# Altium schematic sheet 08 CAN PHY & ETHERNET P.SchDoc
size 513 x 386 mm
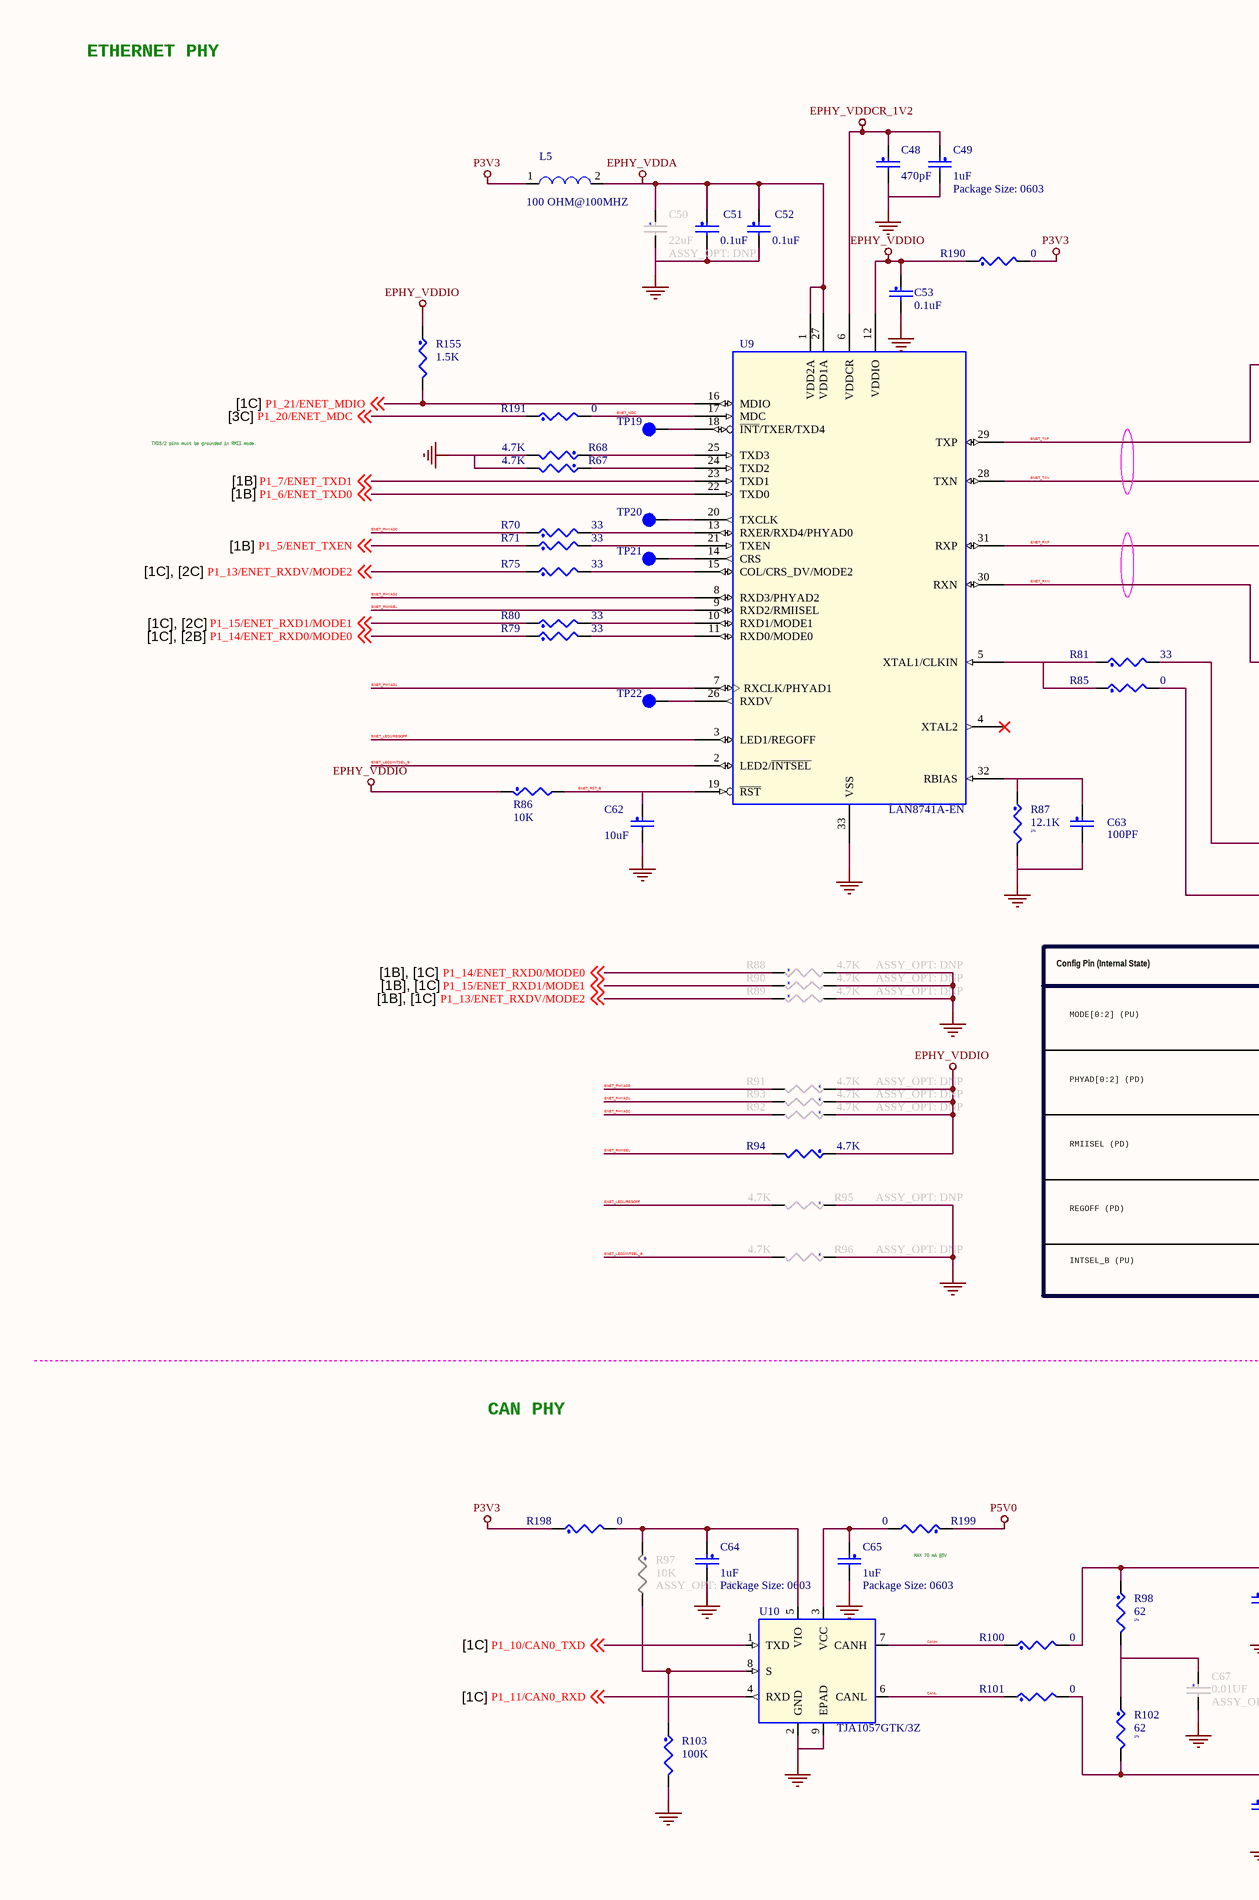
[diagram p0: 08 CAN PHY & ETHERNET P.SchDoc, left]
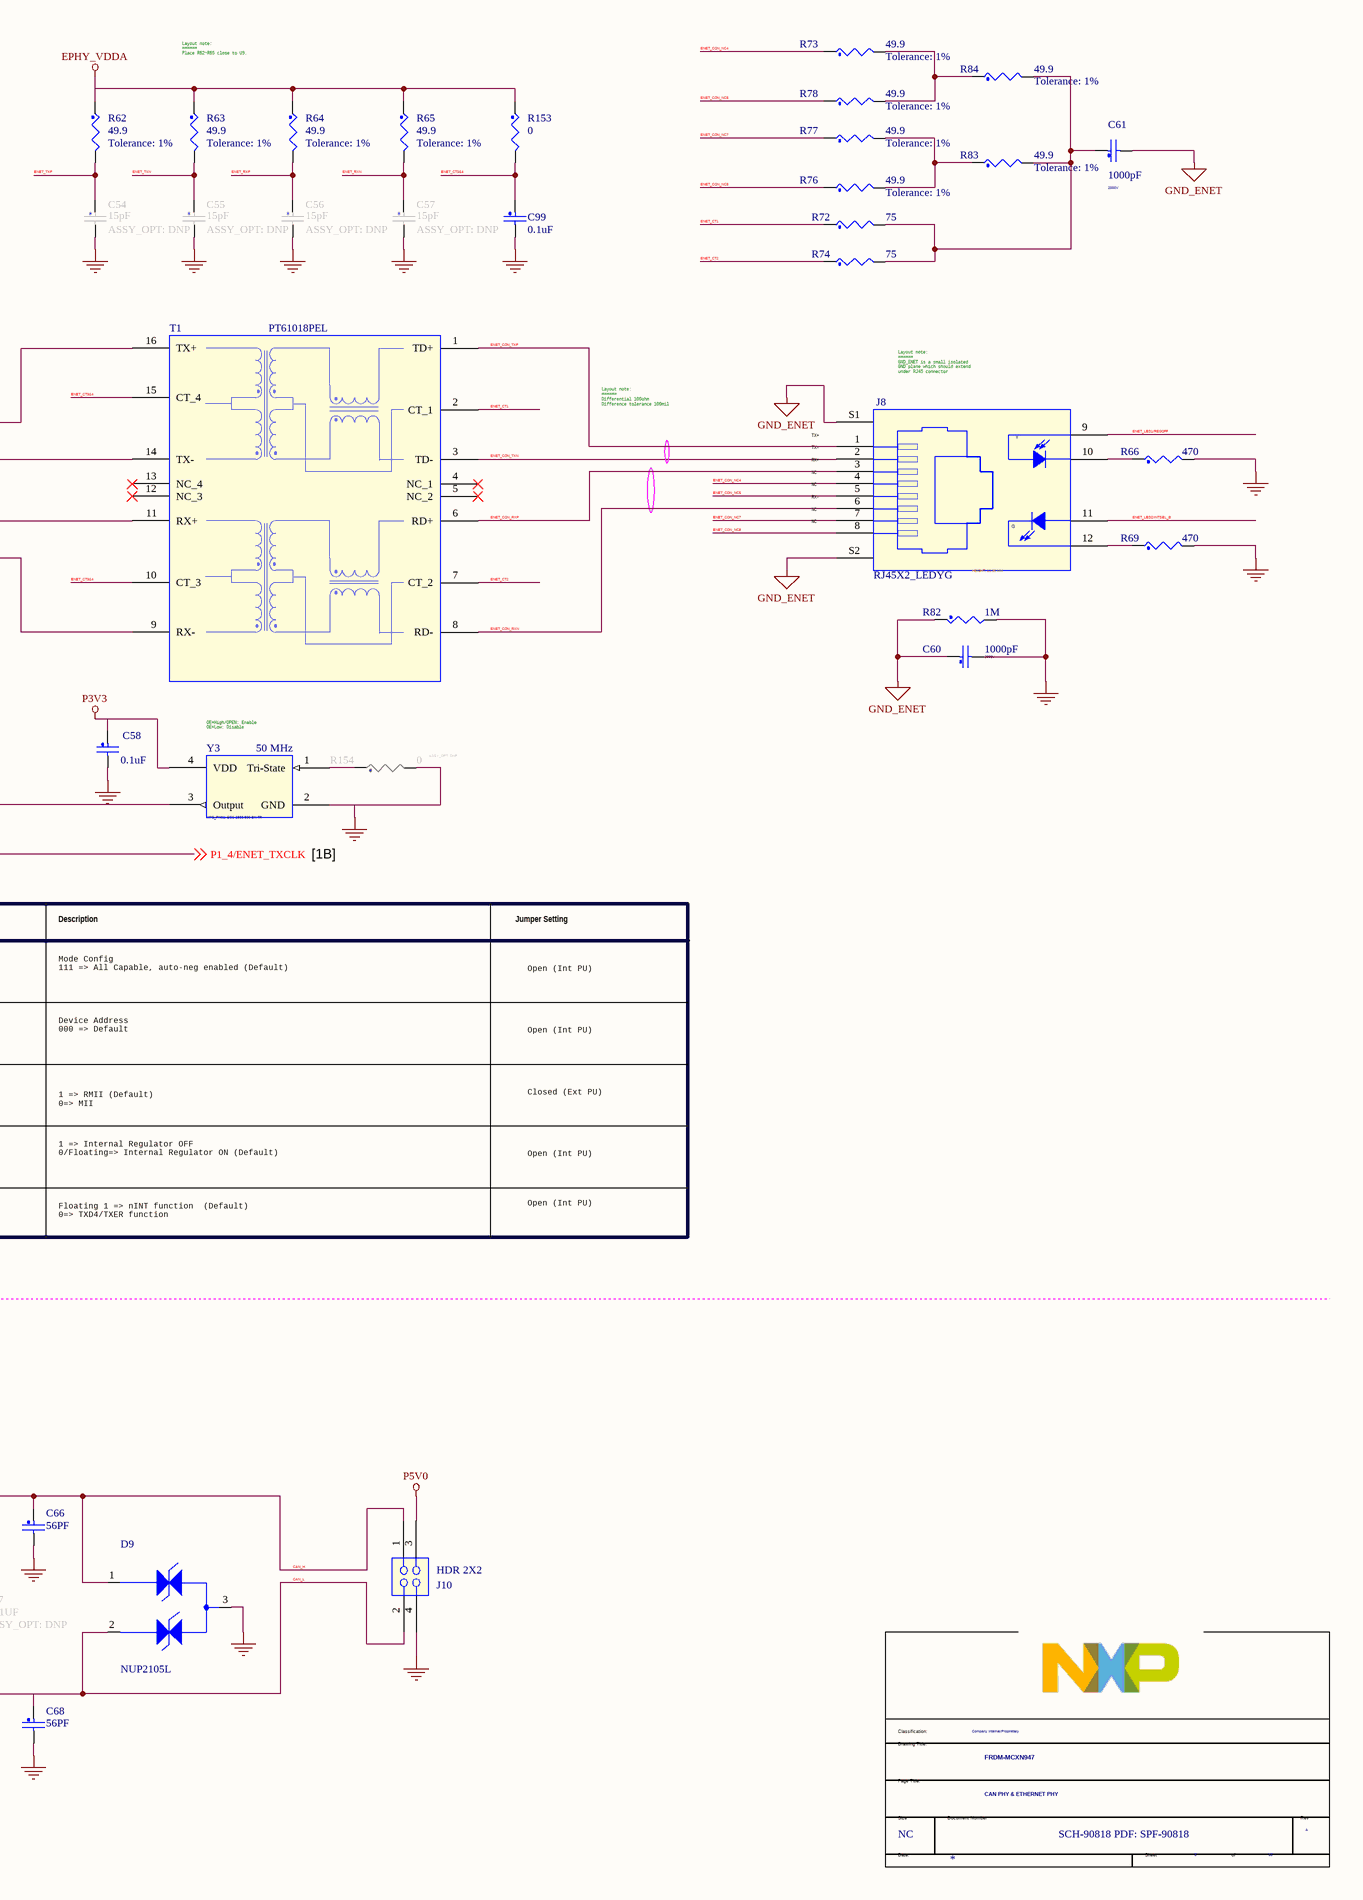
[diagram p1: 08 CAN PHY & ETHERNET P.SchDoc, right]

## Parts
*  Doc: SCH-90818 PDF: SPF-90818  RevCode: A  Title: FRDM-MCXN947  Page Size: NC  Page Number: 8  Page Count: 13  PageTitle: CAN PHY & ETHERNET PHY  Classification: Company Internal/Proprietary  (hidden comment: TitleBlock_FS)  (graphical)
C48  470pF  [CC0402_25]
C49  1uF  Package Size: 0603  [CC0603_OV]
C50  22uF  ASSY_OPT: DNP  [CC0603_OV]
C51  0.1uF  [CC0402_25]
C52  0.1uF  [CC0402_25]
C53  0.1uF  [CC0402_25]
C54  15pF  ASSY_OPT: DNP  [CC0402_25]
C55  15pF  ASSY_OPT: DNP  [CC0402_25]
C56  15pF  ASSY_OPT: DNP  [CC0402_25]
C57  15pF  ASSY_OPT: DNP  [CC0402_25]
C58  0.1uF  [CC0402_25]
C60  1000pF  Rated Voltage: 2000V  [CC1206_OV]
C61  1000pF  Rated Voltage: 2000V  [CC1206_OV]
C62  10uF  [CC0603_OV]
C63  100PF  [CC0402_25]
C64  1uF  Package Size: 0603  [CC0603_OV]
C65  1uF  Package Size: 0603  [CC0603_OV]
C66  56PF  [CC0402_25]
C67  0.01UF  ASSY_OPT: DNP  [CC0402_25]
C68  56PF  [CC0402_25]
C99  0.1uF  [CC0402_25]
D9  NUP2105L  [sot-23]
J8  RJ45X2_LEDYG  HEIGHT: 11.35 MM  [con12p_1p02_16p48x15p5_ra_th]
J10  HDR 2X2  [hdr2x2_2p54_th]
L5  100 OHM@100MHZ  [ind_1608]
R62  49.9  Tolerance: 1%  [RC0402_25]
R63  49.9  Tolerance: 1%  [RC0402_25]
R64  49.9  Tolerance: 1%  [RC0402_25]
R65  49.9  Tolerance: 1%  [RC0402_25]
R66  470  [RC0402_25]
R67  4.7K  [RC0402_25]
R68  4.7K  [RC0402_25]
R69  470  [RC0402_25]
R70  33  [RC0402_25]
R71  33  [RC0402_25]
R72  75  [RC0402_25]
R73  49.9  Tolerance: 1%  [RC0402_25]
R74  75  [RC0402_25]
R75  33  [RC0402_25]
R76  49.9  Tolerance: 1%  [RC0402_25]
R77  49.9  Tolerance: 1%  [RC0402_25]
R78  49.9  Tolerance: 1%  [RC0402_25]
R79  33  [RC0402_25]
R80  33  [RC0402_25]
R81  33  [RC0402_25]
R82  1M  [RC0805_OV]
R83  49.9  Tolerance: 1%  [RC0402_25]
R84  49.9  Tolerance: 1%  [RC0402_25]
R85  0  [RC0603_OV]
R86  10K  [RC0402_25]
R87  12.1K  Tolerance: 1%  [RC0402_25]
R88  4.7K  ASSY_OPT: DNP  [RC0402_25]
R89  4.7K  ASSY_OPT: DNP  [RC0402_25]
R90  4.7K  ASSY_OPT: DNP  [RC0402_25]
R91  4.7K  ASSY_OPT: DNP  [RC0402_25]
R92  4.7K  ASSY_OPT: DNP  [RC0402_25]
R93  4.7K  ASSY_OPT: DNP  [RC0402_25]
R94  4.7K  [RC0402_25]
R95  4.7K  ASSY_OPT: DNP  [RC0402_25]
R96  4.7K  ASSY_OPT: DNP  [RC0402_25]
R97  10K  ASSY_OPT: DNP  [RC0402_25]
R98  62  Tolerance: 1%  [RC0805_OV]
R100  0  [RC0603_OV]
R101  0  [RC0603_OV]
R102  62  Tolerance: 1%  [RC0805_OV]
R103  100K  [RC0402_25]
R153  0  [RC0603_OV]
R154  0  ASSY_OPT: DNP  [RC0603_OV]
R155  1.5K  [RC0402_25]
R190  0  [RC0603_OV]
R191  0  [RC0603_OV]
R198  0  [RC0402_25]
R199  0  [RC0402_25]
T1  PT61018PEL  [xfmr16_1p27_13p05x7p15]
TP19  TPAD_030  [TPAD_030]  (value not drawn)
TP20  TPAD_030  [TPAD_030]  (value not drawn)
TP21  TPAD_030  [TPAD_030]  (value not drawn)
TP22  TPAD_030  [TPAD_030]  (value not drawn)
U9  LAN8741A-EN  [QFN32EP]
U10  TJA1057GTK/3Z  [son8_0p65_3p15x3p15]
Y3  50 MHz  MFG_PN01: ECS-2333-500-BN-TR  [osc4_3p2x2p5_sm]

## Nets
EPHY_VDDA: C50.1 C51.1 C52.1 L5.2 R62.1 R63.1 R64.1 R65.1 R153.1 U9.1(VDD2A) U9.27(VDD1A)
EPHY_VDDCR_1V2: C48.1 C49.1 U9.6(VDDCR)
EPHY_VDDIO: C53.1 R86.1 R91.1 R92.1 R93.1 R94.1 R155.1 R190.1 U9.12(VDDIO)
GND: C48.2 C49.2 C50.2 C51.2 C52.2 C53.2 C54.2 C55.2 C56.2 C57.2 C58.2 C60.2 C62.2 C63.2 C64.2 C65.2 C66.2 C67.2 C68.2 C99.2 D9.3(ANODES) J10.4(B2) R66.2 R67.2 R68.2 R69.2 R82.2 R87.2 R88.2 R89.2 R90.2 R95.1 R96.1 R103.2 R154.2 U9.33(VSS) U10.2(GND) U10.9(EPAD) Y3.2(GND)
GND_ENET: C60.1 C61.2 J8.S1(SHIELD_1) J8.S2(SHIELD_2) R82.1
P3V3: C58.1 L5.1 R190.2 R198.1 Y3.4(VDD)
P5V0: J10.3(A2) R199.1
CAN_H: C66.1 D9.1(CATHODE1) J10.1(A1) R98.1 R100.2
CAN_L: C68.1 D9.2(CATHODE2) J10.2(B1) R101.2 R102.2
CANH: R100.1 U10.7(CANH)
CANL: R101.1 U10.6(CANL)
ENET_CON_NC4: J8.4 R73.1
ENET_CON_NC5: J8.5 R78.1
ENET_CON_NC7: J8.7 R77.1
ENET_CON_NC8: J8.8 R76.1
ENET_CON_RXN: J8.6 T1.8(RD-)
ENET_CON_RXP: J8.3 T1.6(RD+)
ENET_CON_TXN: J8.2 T1.3(TD-)
ENET_CON_TXP: J8.1 T1.1(TD+)
ENET_CT1: R72.1 T1.2(CT_1)
ENET_CT2: R74.1 T1.7(CT_2)
ENET_CT3&4: C99.1 R153.2 T1.10(CT_3) T1.15(CT_4)
ENET_LED1/REGOFF: J8.9 R95.2 U9.3(LED1/REGOFF)
ENET_LED2/INTSEL_B: J8.11 R96.2 U9.2(LED2/~{INTSEL})
ENET_MDC: R191.2 U9.17(MDC)
ENET_PHYAD0: R70.1 R91.2
ENET_PHYAD1: R93.2 U9.7(RXCLK/PHYAD1)
ENET_PHYAD2: R92.2 U9.8(RXD3/PHYAD2)
ENET_RMIISEL: R94.2 U9.9(RXD2/RMIISEL)
ENET_RST_B: C62.1 R86.2 U9.19(~{RST})
ENET_RXN: C57.1 R65.2 T1.9(RX-) U9.30(RXN)
ENET_RXP: C56.1 R64.2 T1.11(RX+) U9.31(RXP)
ENET_TXN: C55.1 R63.2 T1.14(TX-) U9.28(TXN)
ENET_TXP: C54.1 R62.2 T1.16(TX+) U9.29(TXP)
P1_4/ENET_TXCLK: R85.2 ; off-sheet P1_4/ENET_TXCLK
P1_5/ENET_TXEN: R71.1 ; off-sheet P1_5/ENET_TXEN
P1_6/ENET_TXD0: U9.22(TXD0) ; off-sheet P1_6/ENET_TXD0
P1_7/ENET_TXD1: U9.23(TXD1) ; off-sheet P1_7/ENET_TXD1
P1_10/CAN0_TXD: U10.1(TXD) ; off-sheet P1_10/CAN0_TXD
P1_11/CAN0_RXD: U10.4(RXD) ; off-sheet P1_11/CAN0_RXD
P1_13/ENET_RXDV/MODE2: R75.1 R89.1 ; off-sheet P1_13/ENET_RXDV/MODE2
P1_14/ENET_RXD0/MODE0: R79.1 R88.1 ; off-sheet P1_14/ENET_RXD0/MODE0
P1_15/ENET_RXD1/MODE1: R80.1 R90.1 ; off-sheet P1_15/ENET_RXD1/MODE1
P1_20/ENET_MDC: R191.1 ; off-sheet P1_20/ENET_MDC
P1_21/ENET_MDIO: R155.2 U9.16(MDIO) ; off-sheet P1_21/ENET_MDIO
NetC61_1: C61.1 R72.2 R74.2 R83.2 R84.2
NetC63_1: C63.1 R87.1 U9.32(RBIAS)
NetC64_1: C64.1 R97.1 R198.2 U10.5(VIO)
NetC65_1: C65.1 R199.2 U10.3(VCC)
NetC67_1: C67.1 R98.2 R102.1
NetJ8_10: J8.10 R66.1
NetJ8_12: J8.12 R69.1
NetR67_1: R67.1 U9.24(TXD2)
NetR68_1: R68.1 U9.25(TXD3)
NetR70_2: R70.2 U9.13(RXER/RXD4/PHYAD0)
NetR71_2: R71.2 U9.21(TXEN)
NetR73_2: R73.2 R78.2 R84.1
NetR75_2: R75.2 U9.15(COL/CRS_DV/MODE2)
NetR76_2: R76.2 R77.2 R83.1
NetR79_2: R79.2 U9.11(RXD0/MODE0)
NetR80_2: R80.2 U9.10(RXD1/MODE1)
NetR81_1: R81.1 R85.1 U9.5(XTAL1/CLKIN)
NetR81_2: R81.2 Y3.3(Output)
NetR97_2: R97.2 R103.1 U10.8(S)
NetR154_1: R154.1 Y3.1(Tri-State)
NetTP19_1: TP19.1(Pin1) U9.18(~{INT}/TXER/TXD4)
NetTP20_1: TP20.1(Pin1) U9.20(TXCLK)
NetTP21_1: TP21.1(Pin1) U9.14(CRS)
NetTP22_1: TP22.1(Pin1) U9.26(RXDV)

Not connected (* = marked no-connect by the designer): T1 4(NC_1)* 5(NC_2)* 12(NC_3)* 13(NC_4)*; U9 4(XTAL2)*

## Notes on the sheet
- ETHERNET PHY
- Layout note:
  ======
  Place R62~R65 close to U9.
- TXD3/2 pins must be grounded in RMII mode.
- (near J8) Layout note:
  ======
  GND_ENET is a small isolated
  GND plane which should extend
  under RJ45 connector
- Layout note:
  ======
  Differential 100ohm
  Difference tolerance 100mil
- RX+
- TX-
- NC
- TX+
- RX-
- OE=High/OPEN: Enable
  OE=Low: Disable
- Config Pin (Internal State)
- MODE[0:2] (PU)
- Mode Config
  111 => All Capable, auto-neg enabled (Default)
- Description
- Jumper Setting
- Open (Int PU)
- PHYAD[0:2] (PD)
- Device Address
  000 => Default
- RMIISEL (PD)
- Closed (Ext PU)
- REGOFF (PD)
- 1 => RMII (Default)
  0=> MII
- 1 => Internal Regulator OFF
  0/Floating=> Internal Regulator ON (Default)
- INTSEL_B (PU)
- Floating 1 => nINT function  (Default)
  0=> TXD4/TXER function
- CAN PHY
- (near R199) MAX 70 mA @5V
- (in symbol CON_RJ45_1X8_YG) Y; G
- (in symbol TitleBlock_FS) Classification:; Drawing Title:; Page Title:; Size; Document Number; Rev; Date:; Sheet; of

## Library data of the parts
* = TitleBlock_FS: Classification: Public, Company Internal/Proprietary, Company Confidential,  Company Secret; OrgName: NXP Semiconductors; OrgAddr1: 6501 William Cannon Drive West; OrgAddr2: Austin, TX 78735-8598; Variant Name: <Core Design>; Page Create Date: March  8, 1995; Page Modify Date: *
C48 = CAP_NP: CAP CER 470pF 50V 5% C0G 0402; CLASS: DISCRETE; MFG_PN01: GRM1555C1H471JA01D; MFG_NAME01: MURATA; Temp Range: -55C to +125C; CAD_APPROVED: YES; FPLIST: CC0402_25,CC0402_HD,0402_CC,capc0402_l; AGILE_PN: 150-30004; PCB Footprint: CC0402_25; ROHS: Yes; Rated Voltage: 50V; Tolerance: 5%; HEIGHT: 0.55MM; Package Size: 0402
C49 C65 = CAP_NP: CAP CER 1uF 16V 20% X5R 0603; CLASS: DISCRETE; MFG_PN01: 885012106017; MFG_NAME01: WURTH ELEKTRONIK; Temp Range: -55C TO 85C; CAD_APPROVED: Yes; FPLIST: CC0603_OV,CC0603,0603_CC; AGILE_PN: 150-81891; PCB Footprint: CC0603_OV; 3D_Mechanical_Footprint_File: http://fcl.am.freescale.net/ALLEGRO/step/cc0603_ov.STEP; VOLTAGE: 16V; ROHS: Yes; Rated Voltage: 16V; Tolerance: 20%; Package Type: WCAP-CSGP_0603; HEIGHT: 0.87MM
C50 = CAP_NP: CAP CER 22uF 10V 20% X5R 0603; CLASS: DISCRETE; MFG_PN01: CL10A226MP7LUNC; MFG_NAME01: SAMSUNG; Temp Range: -55C to +85C; CAD_APPROVED: Yes; FPLIST: CC0603_OV,CC0603,0603_cc_tol; AGILE_PN: 150-79530; PCB Footprint: CC0603_OV; ROHS: Yes; Rated Voltage: 10V; Tolerance: 20%; HEIGHT: 1MM; Package Size: 0603
C51 C52 C99 = CAP_NP: CAP CER 0.1UF 16V 10% X7R 0402; CLASS: DISCRETE; Temp Range: -55C to +125C; SIGNAL_MODEL: DEFAULT_CAPACITOR_100000pF_2_1; AGILE_PN: 150-75182; MFG_NAME01: Samsung Electro-Mechanics; MFG_PN01: CL05B104KO5NNNC; CAD_APPROVED: Yes; FPLIST: CC0402_25,CC0402_HD,0402_CC,CAPC0402_L,cc0402_lamp3; Temp_Range: -55°C to +85°C; PCB Footprint: CC0402_25; 3D_Mechanical_Footprint_File: http://fcl.am.freescale.net/ALLEGRO/step/cc0402_25.STEP; Rated Voltage: 16V; Tolerance: 10%; ROHS: Yes; HEIGHT: 0.635MM; TOL: 10%; VOLTAGE: 16V
C53 C58 = CAP_NP: CAP CER 0.1UF 16V 10% X7R 0402; CLASS: DISCRETE; Temp_Range: -55°C to +85°C; FPLIST: CC0402_25,CC0402_HD,0402_CC,CAPC0402_L,cc0402_lamp3; CAD_APPROVED: Yes; MFG_PN01: CL05B104KO5NNNC; MFG_NAME01: Samsung Electro-Mechanics; AGILE_PN: 150-75182; SIGNAL_MODEL: DEFAULT_CAPACITOR_100000pF_2_1; Temp Range: -55C to +125C; PCB Footprint: CC0402_25; VOLTAGE: 16V; TOL: 10%; HEIGHT: 0.635MM; ROHS: Yes; Tolerance: 10%; Rated Voltage: 16V; 3D_Mechanical_Footprint_File: http://fcl.am.freescale.net/ALLEGRO/step/cc0402_25.STEP
C54-C57 = CAP_NP: CAP CER 15pF 50V 5% C0G 0402; CLASS: DISCRETE; MFG_PN01: GJM1555C1H150JB01D; MFG_NAME01: Murata Electronics; Temp Range: -55¡ãC ~ 125¡ãC; CAD_APPROVED: Yes; FPLIST: CC0402_25,CC0402_HD,0402_CC,capc0402_l; AGILE_PN: 150-81667; PCB Footprint: CC0402_25; 3D_Mechanical_Footprint_File: http://fcl.am.freescale.net/ALLEGRO/step/cc0402_25.STEP; ROHS: Yes; Rated Voltage: 50V; Tolerance: 5%; Package Type: Surface Mount, MLCC; HEIGHT: 0.55 MM; Package Size: 0402 (1005 Metric)
C60 = CAP_NP: CAP CER 1000pF 2KV 10% X7R 1206; CLASS: DISCRETE; AGILE_PN: 150-79103; FPLIST: CC1206_OV,CC1206,1206_CC; CAD_APPROVED: Yes; Temp Range: -55C to +125C; MFG_NAME01: WALSIN TECHNOLOGY CORP.; MFG_PN01: 1206B102K202CT; PCB Footprint: CC1206_OV; Package Size: 1206; HEIGHT: 1.8MM; Tolerance: 10%; ROHS: Yes
C61 = CAP_NP: CAP CER 1000pF 2KV 10% X7R 1206; CLASS: DISCRETE; MFG_PN01: 1206B102K202CT; MFG_NAME01: WALSIN TECHNOLOGY CORP.; Temp Range: -55C to +125C; CAD_APPROVED: Yes; FPLIST: CC1206_OV,CC1206,1206_CC; AGILE_PN: 150-79103; PCB Footprint: CC1206_OV; ROHS: Yes; Tolerance: 10%; HEIGHT: 1.8MM; Package Size: 1206
C62 = CAP_NP: CAP CER 10uF 25V 10% X5R 0603; CLASS: DISCRETE; MFG_PN01: C0603X5R106K250NT; MFG_NAME01: SANYEAR; CAD_APPROVED: Yes; AGILE_PN: 150-79569; PCB Footprint: CC0603_OV; 3D_Mechanical_Footprint_File: http://fcl.am.freescale.net/ALLEGRO/step/cc0603_ov.STEP; ROHS: Yes; Rated Voltage: 25V; Tolerance: 10%; Package Type: SMD/SMT; HEIGHT: 1MM; Package Size: 0603 [1608 Metric]
C63 = CAP_NP: CAP CER 100pF 16V 10% X7R 0402; CLASS: DISCRETE; MFG_PN01: 0402YC101KAT2A; MFG_NAME01: AVX; Temp Range: -55C to +125C; CAD_APPROVED: Yes; FPLIST: CC0402_25,CC0402_HD,0402_CC,capc0402_l; AGILE_PN: 150-79188; PCB Footprint: CC0402_25; ROHS: Yes; Rated Voltage: 16V; Tolerance: 10%; Package Type: 7" Reel; HEIGHT: 0.56 MM; Package Size: 0402
C64 = CAP_NP: CAP CER 1uF 16V 20% X5R 0603; CLASS: DISCRETE; AGILE_PN: 150-81891; FPLIST: CC0603_OV,CC0603,0603_CC; CAD_APPROVED: Yes; Temp Range: -55C TO 85C; MFG_NAME01: WURTH ELEKTRONIK; MFG_PN01: 885012106017; PCB Footprint: CC0603_OV; HEIGHT: 0.87MM; Package Type: WCAP-CSGP_0603; Tolerance: 20%; Rated Voltage: 16V; ROHS: Yes; VOLTAGE: 16V; 3D_Mechanical_Footprint_File: http://fcl.am.freescale.net/ALLEGRO/step/cc0603_ov.STEP
C66 C68 = CAP_NP: CAP CER 56PF 50V 5% C0G 0402; CLASS: DISCRETE; AGILE_PN: 150-30269; FPLIST: CC0402_25,CC0402_HD,0402_CC,capc0402_l; CAD_APPROVED: Yes; Temp Range: -55C to +125C; MFG_NAME01: VENKEL COMPANY; MFG_PN01: C0402C0G500-560JNE; PCB Footprint: CC0402_25; HEIGHT: 0.55 MM; Tolerance: 5%; Rated Voltage: 50V; ROHS: Yes
C67 = CAP_NP: CAP CER 0.01UF 50V 10% X7R 0402; CLASS: DISCRETE; MFG_PN01: GRM155R71H103KA88D; MFG_NAME01: MURATA; Temp Range: -55C to +125C; CAD_APPROVED: Yes; FPLIST: CC0402_25,CC0402_HD,0402_CC,capc0402_l; AGILE_PN: 150-30114; PCB Footprint: CC0402_25; ROHS: Yes; Rated Voltage: 50V; Tolerance: 10%; HEIGHT: 0.55 MM
D9 = DIODE_NUP2105L: DIODE DUAL LINE CAN BUS PROTECTOR 27V 350W SOT-23; CLASS: IC; MFG_PN01: NUP2105LT1G; MFG_NAME01: ON SEMICONDUCTOR; CAD_APPROVED: Yes; AGILE_PN: 480-77157; PCB Footprint: sot-23; HEIGHT: 1.11MM
J8 = CON_RJ45_1X8_YG: CON 8 RJ-45 SHLD RA TH YG LEDS 40MIL SP 47H AU 79L; CLASS: IO; MFG_PN01: MJ88B-B011-RVL11-P; MFG_NAME01: Donguan Heling Electronic Co., LTD; CAD_APPROVED: Yes; AGILE_PN: 210-83436; PCB Footprint: con12p_1p02_16p48x15p5_ra_th; ROHS: Yes; Package Type: Through Hole
J10 = CONN_HDR_2X2: HDR 2X2 TH 100MIL CTR 330H AU 120L; CLASS: IO; MFG_PN01: PBC02DAAN; MFG_NAME01: Sullins Connector Solutions; Temp Range: -65 to +125 ¡ãC; CAD_APPROVED: Yes; AGILE_PN: 210-83038; 3D_Mechanical_Footprint_File: http://fcl.am.freescale.net/ALLEGRO/step/hdr2x2_2p54_th.STEP; ROHS: Yes; Contact Voltage: -; Package Type: Through Hole; HEIGHT: 8.38 MM; PCB Footprint: hdr2x2_2p54_th
L5 = IND: IND FER BEAD 100 OHM@100MHZ 1A 25% 0603; CLASS: DISCRETE; MFG_PN01: MPZ1608D101B; MFG_NAME01: TDK; CAD_APPROVED: Yes; FPLIST: ind_1608,0603_CC; AGILE_PN: 180-75495; PCB Footprint: ind_1608; ROHS: Yes; HEIGHT: 0.95MM; Package Size: 1.6x0.8x0.8mm
R62-R65 R76 R78 R83 = RES: RES MF 49.9 OHM 1/16W 1% 0402; CLASS: DISCRETE; MFG_PN01: CR0402-FX-49R9GLF; MFG_NAME01: BOURNS; CAD_APPROVED: Yes; FPLIST: RC0402_25,RC0402_HD,0402_CC; AGILE_PN: 470-75360; PCB Footprint: RC0402_25; ROHS: Yes; HEIGHT: 0.4MM
R66 = RES: RES MF 470 OHM 1/16W 5% 0402; CLASS: DISCRETE; Temp_Range: -55&#8451; to 155&#8451;; SIGNAL_MODEL: DEFAULT_RESISTOR_430.000000OHM_2_1; FPLIST: RC0402_25,RC0402_HD,0402_CC; CAD_APPROVED: Yes; MFG_PN01: ERJ2GEJ471X; MFG_NAME01: PANASONIC; AGILE_PN: 470-30315; TOL: 1%; PCB Footprint: RC0402_25; ROHS: Yes; Tolerance: 5%; HEIGHT: 0.45mm
R67 R90 R93-R95 = RES: RES MF 4.7K 1/16W 5% 0402; CLASS: DISCRETE; MFG_PN01: CR0402-JW-472GLF; MFG_NAME01: BOURNS; CAD_APPROVED: Yes; FPLIST: RC0402_25,RC0402_HD,0402_CC,RC0402_X2; AGILE_PN: 470-75626; Pkg: 0402; PCB Footprint: RC0402_25; ROHS: Yes; Tolerance: 5%; HEIGHT: 0.41mm
R68 R88 R89 R91 R92 R96 = RES: RES MF 4.7K 1/16W 5% 0402; CLASS: DISCRETE; Pkg: 0402; AGILE_PN: 470-75626; FPLIST: RC0402_25,RC0402_HD,0402_CC,RC0402_X2; CAD_APPROVED: Yes; MFG_NAME01: BOURNS; MFG_PN01: CR0402-JW-472GLF; PCB Footprint: RC0402_25; HEIGHT: 0.41mm; Tolerance: 5%; ROHS: Yes
R69 = RES: RES MF 470 OHM 1/16W 5% 0402; CLASS: DISCRETE; TOL: 1%; AGILE_PN: 470-30315; MFG_NAME01: PANASONIC; MFG_PN01: ERJ2GEJ471X; CAD_APPROVED: Yes; FPLIST: RC0402_25,RC0402_HD,0402_CC; SIGNAL_MODEL: DEFAULT_RESISTOR_430.000000OHM_2_1; Temp_Range: -55&#8451; to 155&#8451;; PCB Footprint: RC0402_25; HEIGHT: 0.45mm; Tolerance: 5%; ROHS: Yes
R70 R75 R80 R81 = RES: RES MF 33.0 OHM 1/16W 1% 0402; CLASS: DISCRETE; MFG_PN01: CR0402FX33R0GLF; MFG_NAME01: BOURNS; CAD_APPROVED: Yes; FPLIST: RC0402_25,RC0402_HD,RC0402_X2,0402_CC; AGILE_PN: 470-75790; PCB Footprint: RC0402_25; ROHS: Yes; Tolerance: 1%; HEIGHT: 0.4MM
R71 R79 = RES: RES MF 33.0 OHM 1/16W 1% 0402; CLASS: DISCRETE; AGILE_PN: 470-75790; FPLIST: RC0402_25,RC0402_HD,RC0402_X2,0402_CC; CAD_APPROVED: Yes; MFG_NAME01: BOURNS; MFG_PN01: CR0402FX33R0GLF; PCB Footprint: RC0402_25; HEIGHT: 0.4MM; Tolerance: 1%; ROHS: Yes
R72 = RES: RES MF 75.0 OHM 1/10W 1% AEC-Q200 0402; CLASS: DISCRETE; MFG_PN01: RK73H1ETTP75R0F; MFG_NAME01: KOA SPEER; Temp Range: -55¡ãC to +155¡ãC; CAD_APPROVED: Yes; FPLIST: RC0402_25,RC0402_HD,0402_CC; AGILE_PN: 470-30729; PCB Footprint: RC0402_25; ROHS: Yes; Tolerance: 1%; HEIGHT: 0.40 MM
R73 R77 R84 = RES: RES MF 49.9 OHM 1/16W 1% 0402; CLASS: DISCRETE; AGILE_PN: 470-75360; FPLIST: RC0402_25,RC0402_HD,0402_CC; CAD_APPROVED: Yes; MFG_NAME01: BOURNS; MFG_PN01: CR0402-FX-49R9GLF; PCB Footprint: RC0402_25; HEIGHT: 0.4MM; ROHS: Yes
R74 = RES: RES MF 75.0 OHM 1/10W 1% AEC-Q200 0402; CLASS: DISCRETE; AGILE_PN: 470-30729; FPLIST: RC0402_25,RC0402_HD,0402_CC; CAD_APPROVED: Yes; Temp Range: -55¡ãC to +155¡ãC; MFG_NAME01: KOA SPEER; MFG_PN01: RK73H1ETTP75R0F; PCB Footprint: RC0402_25; HEIGHT: 0.40 MM; Tolerance: 1%; ROHS: Yes
R82 = RES: RES MF 1M 1/10W 5%  0805; CLASS: DISCRETE; MFG_PN01: RC73L2A105JTF; MFG_NAME01: SMEC; Temp Range: -55¡ãC to +175¡ãC; CAD_APPROVED: Yes; FPLIST: RC0805_OV,RC0805,0805_CC; AGILE_PN: 470-76691; PCB Footprint: RC0805_OV; ROHS: Yes; Tolerance: 5%; HEIGHT: 0.55MM
R85 R101 R153 R154 = RES: RES MF ZERO OHM 1/10W -- 0603; CLASS: DISCRETE; AGILE_PN: 470-80866; FPLIST: RC0603_OV,RC0603,R603-X2,r603-x2_b,0603_CC,IND_0603HP_NSP,CC0603_OV_NSP; CAD_APPROVED: Yes; Temp Range: ¨C55 ¡ãC to +155 ¡ãC; MFG_NAME01: YAGEO AMERICA; MFG_PN01: RC0603FR-070RL; PCB Footprint: RC0603_OV; HEIGHT: 0.6MM; ROHS: Yes
R86 = RES: RES MF 10K 1/16W 1% 0402; CLASS: DISCRETE; MFG_PN01: NRCL04F1002TRF; MFG_NAME01: NIC COMPONENTS CORP; CAD_APPROVED: Yes; FPLIST: RC0402_25,RC0402_HD,0402_CC,RC0402_X2; AGILE_PN: 470-80452; PCB Footprint: RC0402_25; ROHS: Yes; Tolerance: 1%; HEIGHT: 0.40 MM
R87 = RES: RES MF 12.1K 1/16W 1% 0402; CLASS: DISCRETE; AGILE_PN: 470-76098; FPLIST: RC0402_25,RC0402_HD,0402_CC; CAD_APPROVED: Yes; MFG_NAME01: BOURNS; MFG_PN01: CR0402-FX-1212GLF; PCB Footprint: RC0402_25; HEIGHT: 0.4 MM; ROHS: Yes
R97 = RES: RES MF 10K 1/16W 1% 0402; CLASS: DISCRETE; Temp_Range: –55 °C to +155 °C; SIGNAL_MODEL: DEFAULT_RESISTOR_10000OHM_2_1; AGILE_PN: 470-80452; MFG_NAME01: NIC COMPONENTS CORP; MFG_PN01: NRCL04F1002TRF; CAD_APPROVED: Yes; FPLIST: RC0402_25,RC0402_HD,0402_CC,RC0402_X2; TOL: 5%; Tolerance: 1%; ROHS: Yes; HEIGHT: 0.40 MM; PCB Footprint: RC0402_25
R98 R102 = RES: RES MF 62 OHM 1/4W 1% AEC-Q200 0805; CLASS: DISCRETE; MFG_PN01: SG73P2ATTD62R0F; MFG_NAME01: KOA SPEER; Temp Range: -55 ¡ãC to +155 ¡ãC; CAD_APPROVED: Yes; FPLIST: RC0805_OV,RC0805,0805_CC; AGILE_PN: 470-83214; PCB Footprint: RC0805_OV; 3D_Mechanical_Footprint_File: http://fcl.am.freescale.net/ALLEGRO/step/RC0805_OV.STEP; ROHS: Yes; HEIGHT: 0.60 MM; Package Size: 0805 (2012 Metric)
R100 R190 R191 = RES: RES MF ZERO OHM 1/10W -- 0603; CLASS: DISCRETE; MFG_PN01: RC0603FR-070RL; MFG_NAME01: YAGEO AMERICA; Temp Range: ¨C55 ¡ãC to +155 ¡ãC; CAD_APPROVED: Yes; FPLIST: RC0603_OV,RC0603,R603-X2,r603-x2_b,0603_CC,IND_0603HP_NSP,CC0603_OV_NSP; AGILE_PN: 470-80866; PCB Footprint: RC0603_OV; ROHS: Yes; HEIGHT: 0.6MM
R103 = RES: RES MF 100K 1/16W 1% 0402; CLASS: DISCRETE; AGILE_PN: 470-76240; FPLIST: RC0402_25,RC0402_HD,0402_CC; CAD_APPROVED: Yes; MFG_NAME01: BOURNS; MFG_PN01: CR0402-FX-1003GLF; PCB Footprint: RC0402_25; HEIGHT: 0.4MM; Tolerance: 1%; ROHS: Yes
R155 = RES: RES MF 1.5K 1/16W 1% 0402; CLASS: DISCRETE; AGILE_PN: 470-80487; FPLIST: RC0402_25,RC0402_HD,0402_CC; CAD_APPROVED: Yes; MFG_NAME01: BOURNS; MFG_PN01: CR0402-FX-1501GLF; PCB Footprint: RC0402_25; HEIGHT: 0.4MM; Tolerance: 1%; ROHS: Yes
R198 R199 = RES: RES MF ZERO OHM 1/16W 5% 0402; CLASS: DISCRETE; AGILE_PN: 470-75394; FPLIST: RC0402_25,RC0402_HD,RC0402_X2,0402_CC,rc0402_lamp3; CAD_APPROVED: Yes; MFG_NAME01: BOURNS; MFG_PN01: CR0402-J/-000GLF; PCB Footprint: RC0402_25; HEIGHT: 0.45 MM; Tolerance: 5%; ROHS: Yes
T1 = SM13072APEL_XFMR16P: XFMR LAN 10/100BASE-TX 1CT:1CT SMT; CLASS: IC; AGILE_PN: 560-77654; CAD_APPROVED: Yes; Temp Range: -40C to +85C; MFG_NAME01: BOURNS; PCB Footprint: xfmr16_1p27_13p05x7p15; Package Size: SMD-16; HEIGHT: 5.90 MM; ROHS: Yes; MFG_PN01: PT61018PEL; 3D_Mechanical_Footprint_File: http://fcl.am.freescale.net/ALLEGRO/step/xfmr16_1p27_13p05x7p15.STEP
TP19 = TESTLOOP: TEST POINT PAD 30MIL DIA SMT, NO PART TO ORDER; CLASS: IO; CAD_APPROVED: Yes; MFG_PN01: NOTACOMPONENT; AGILE_PN: 211-76642; PCB Footprint: TPAD_030; HEIGHT: 0.1MM; ROHS: Yes; MFG_NAME01: NOTACOMPONENT; 3D_Mechanical_Footprint_File: http://fcl.am.freescale.net/ALLEGRO/step/tpad_030.STEP
TP20-TP22 = TESTLOOP: TEST POINT PAD 30MIL DIA SMT, NO PART TO ORDER; CLASS: IO; AGILE_PN: 211-76642; MFG_NAME01: NOTACOMPONENT; CAD_APPROVED: Yes; PCB Footprint: TPAD_030; 3D_Mechanical_Footprint_File: http://fcl.am.freescale.net/ALLEGRO/step/tpad_030.STEP; MFG_PN01: NOTACOMPONENT; ROHS: Yes; HEIGHT: 0.1MM
U9 = LAN8710: IC XCVR ETHERNET PHY MII/RMII 1.8-3.3V SQFN32; AGILE_PN: 312-83484; CAD_APPROVED: Yes; Temp Range: -0C to +70C; MFG_NAME01: Microchip Technology; CLASS: IC; PCB Footprint: QFN32EP; Package Size: SQFN-32; HEIGHT: 1 MM; Supply Voltage: 1.8-3.3V; ROHS: Yes; MFG_PN01: LAN8741A-EN; 3D_Mechanical_Footprint_File: http://fcl.am.freescale.net/ALLEGRO/step/qfn32ep.STEP
U10 = TJA1051TK_3_HVSON8: IC XCVR CAN 5MBIT/S 4.75-5.25V AEC-Q100 HVSON8; MFG_NAME01: NXP Semiconductors; Temp Range: -40 ¡ãC to +150 ¡ãC; CAD_APPROVED: Yes; Supply Voltage: 4.75 V to 5.25 V; AGILE_PN: 312-83230; CLASS: IC; 3D_Mechanical_Footprint_File: http://fcl.am.freescale.net/ALLEGRO/step/son8_0p65_3p15x3p15.STEP; MFG_PN01: TJA1057GTK/3Z; ROHS: Yes; HEIGHT: 1 MM; Package Size: HVSON-8; PCB Footprint: son8_0p65_3p15x3p15
Y3 = OSC_ASFL: OSC XO 50MHZ 3.3V SMD; CLASS: IC; MFG_NAME01: ECS INC. INTERNATIONAL; Temp Range: -40  ¡ãC + 85 ¡ãC; CAD_APPROVED: YES; AGILE_PN: 230-78687; PCB Footprint: osc4_3p2x2p5_sm; ROHS: YES; HEIGHT: 1MM; Package Size: 3.2 mm x 2.5 mm